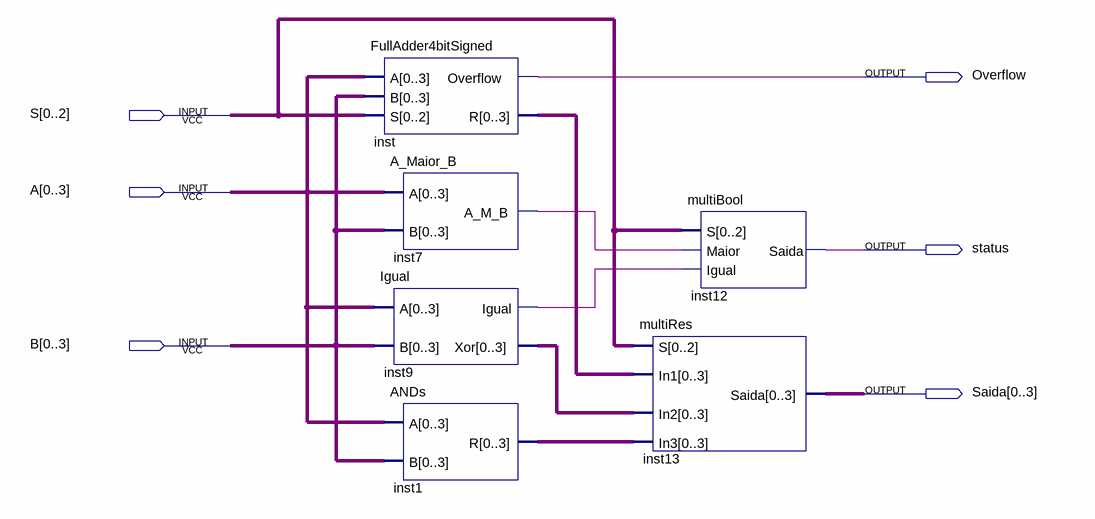
[diagram p0: schematic sheet]
// Quartus schematic ULA.bdf as structural Verilog: 6 symbols, 6 pins
module ULA (
  input  [0:2] S,
  input  [0:3] A,
  input  [0:3] B,
  output Overflow,
  output status,
  output [0:3] Saida
);

  wire inst7_a_m_b, inst9_igual;
  wire [3:0] inst1_r, inst9_xor, inst_r;

  FullAdder4bitSigned inst (.A(A), .B(B), .S(S), .Overflow(Overflow), .R(inst_r));
  A_Maior_B inst7 (.A(A), .B(B), .A_M_B(inst7_a_m_b));
  Igual inst9 (.A(A), .B(B), .Igual(inst9_igual), .Xor(inst9_xor));
  ANDs inst1 (.A(A), .B(B), .R(inst1_r));
  multiRes inst13 (.S(S), .In1(inst_r), .In2(inst9_xor), .In3(inst1_r), .Saida(Saida));
  multiBool inst12 (.S(S), .Maior(inst7_a_m_b), .Igual(inst9_igual), .Saida(status));
endmodule
